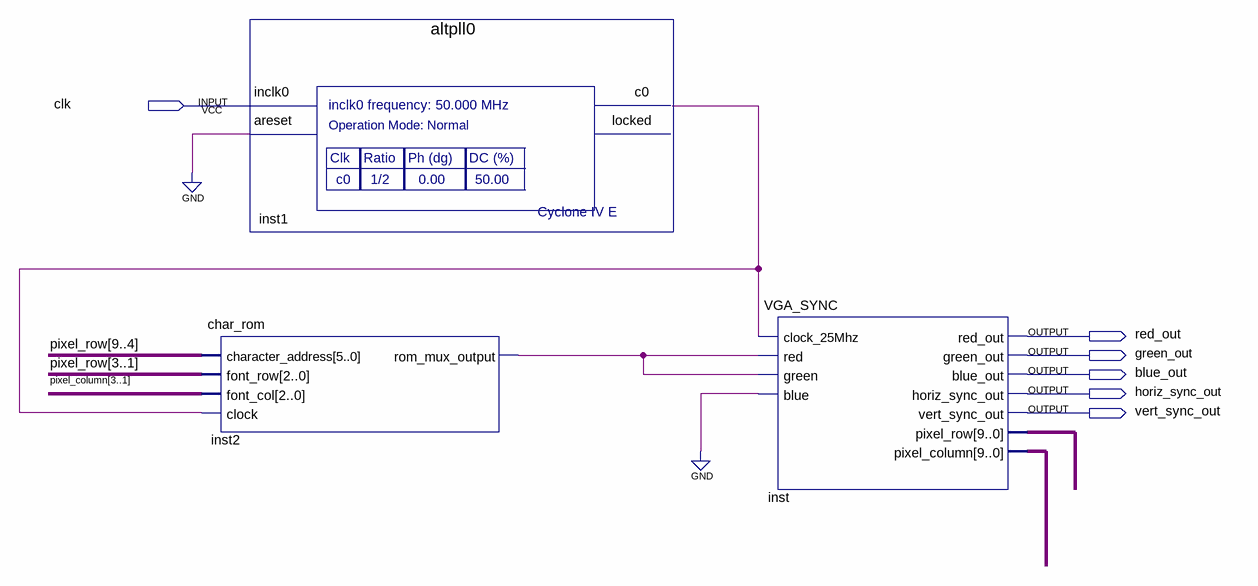
[diagram p0: schematic sheet]
// Quartus schematic Schematic.bdf as structural Verilog: 3 symbols, 6 pins
module Schematic (
  input  clk,
  output red_out,
  output green_out,
  output blue_out,
  output horiz_sync_out,
  output vert_sync_out
);

  wire inst1_c0, inst2_rom_mux_output;
  wire [3:1] pixel_column;
  wire [9:0] inst_pixel_column, inst_pixel_row;
  wire [9:1] pixel_row;

  char_rom inst2 (
    .character_address(pixel_row[9:4]), .font_row(pixel_row[3:1]), .font_col(pixel_column), .clock(inst1_c0),
    .rom_mux_output(inst2_rom_mux_output));
  altpll0 inst1 (.inclk0(clk), .areset(1'b0), .c0(inst1_c0));  // open: locked
  VGA_SYNC inst (
    .clock_25Mhz(inst1_c0), .red(inst2_rom_mux_output), .green(inst2_rom_mux_output), .blue(1'b0),
    .red_out(red_out), .green_out(green_out), .blue_out(blue_out), .horiz_sync_out(horiz_sync_out),
    .vert_sync_out(vert_sync_out), .pixel_row(inst_pixel_row), .pixel_column(inst_pixel_column));
endmodule
